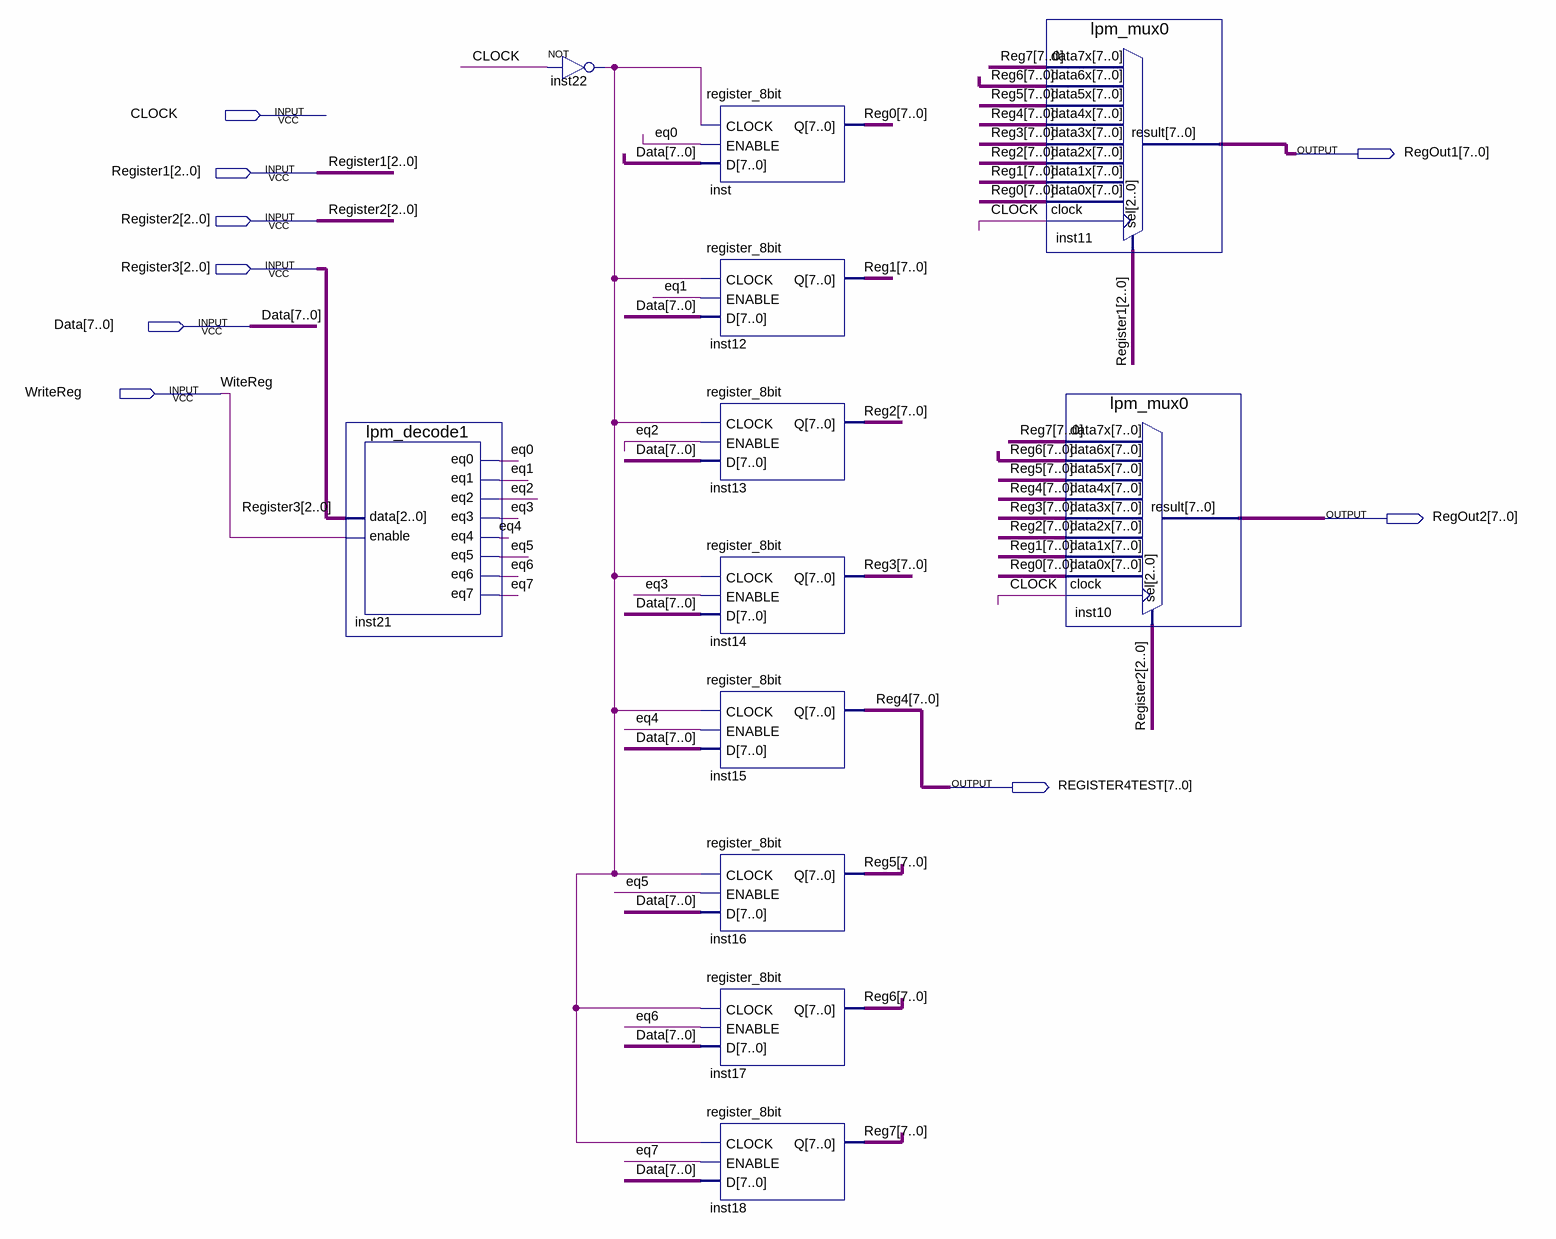
[diagram p0: schematic sheet]
// Quartus schematic RegisterFile.bdf as structural Verilog: 12 symbols, 9 pins
module RegisterFile (
  input  CLOCK,
  input  [2:0] Register1,
  input  [2:0] Register2,
  input  [2:0] Register3,
  input  [7:0] Data,
  input  WriteReg,
  output [7:0] RegOut1,
  output [7:0] RegOut2,
  output [7:0] REGISTER4TEST
);

  wire eq0, eq1, eq2, eq3, eq4, eq5, eq6, eq7, inst22_out;
  wire [7:0] Reg0, Reg1, Reg2, Reg3, Reg5, Reg6, Reg7;

  lpm_decode1 inst21 (
    .data(Register3), .enable(WriteReg), .eq0(eq0), .eq1(eq1), .eq2(eq2), .eq3(eq3), .eq4(eq4), .eq5(eq5),
    .eq6(eq6), .eq7(eq7));
  not inst22 (inst22_out, CLOCK);
  register_8bit inst (.CLOCK(inst22_out), .ENABLE(eq0), .D(Data), .Q(Reg0));
  register_8bit inst12 (.CLOCK(inst22_out), .ENABLE(eq1), .D(Data), .Q(Reg1));
  register_8bit inst13 (.CLOCK(inst22_out), .ENABLE(eq2), .D(Data), .Q(Reg2));
  register_8bit inst14 (.CLOCK(inst22_out), .ENABLE(eq3), .D(Data), .Q(Reg3));
  register_8bit inst15 (.CLOCK(inst22_out), .ENABLE(eq4), .D(Data), .Q(REGISTER4TEST));
  register_8bit inst16 (.CLOCK(inst22_out), .ENABLE(eq5), .D(Data), .Q(Reg5));
  register_8bit inst17 (.CLOCK(inst22_out), .ENABLE(eq6), .D(Data), .Q(Reg6));
  register_8bit inst18 (.CLOCK(inst22_out), .ENABLE(eq7), .D(Data), .Q(Reg7));
  lpm_mux0 inst11 (
    .data7x(Reg7), .data6x(Reg6), .data5x(Reg5), .data4x(REGISTER4TEST), .data3x(Reg3), .data2x(Reg2),
    .data1x(Reg1), .data0x(Reg0), .clock(CLOCK), .sel(Register1), .result(RegOut1));
  lpm_mux0 inst10 (
    .data7x(Reg7), .data6x(Reg6), .data5x(Reg5), .data4x(REGISTER4TEST), .data3x(Reg3), .data2x(Reg2),
    .data1x(Reg1), .data0x(Reg0), .clock(CLOCK), .sel(Register2), .result(RegOut2));

  // Other names for the same wires on the sheet: Reg4[7:0] = REGISTER4TEST; WiteReg = WriteReg
endmodule
